# EasyEDA Pro project ProPrj_PEDRO.epro, board PCB1
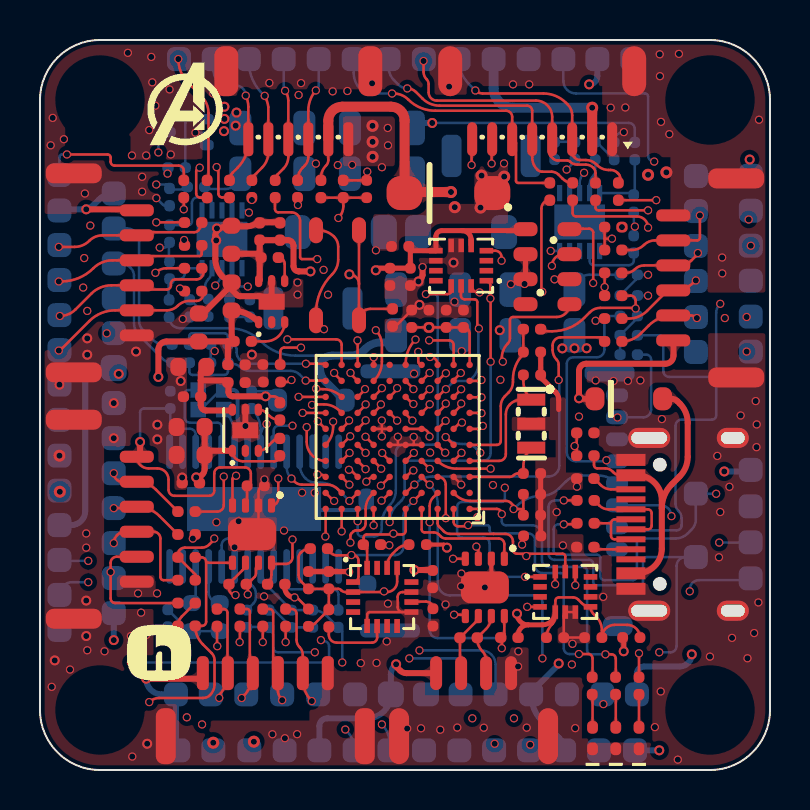
[diagram p4: board, top side]
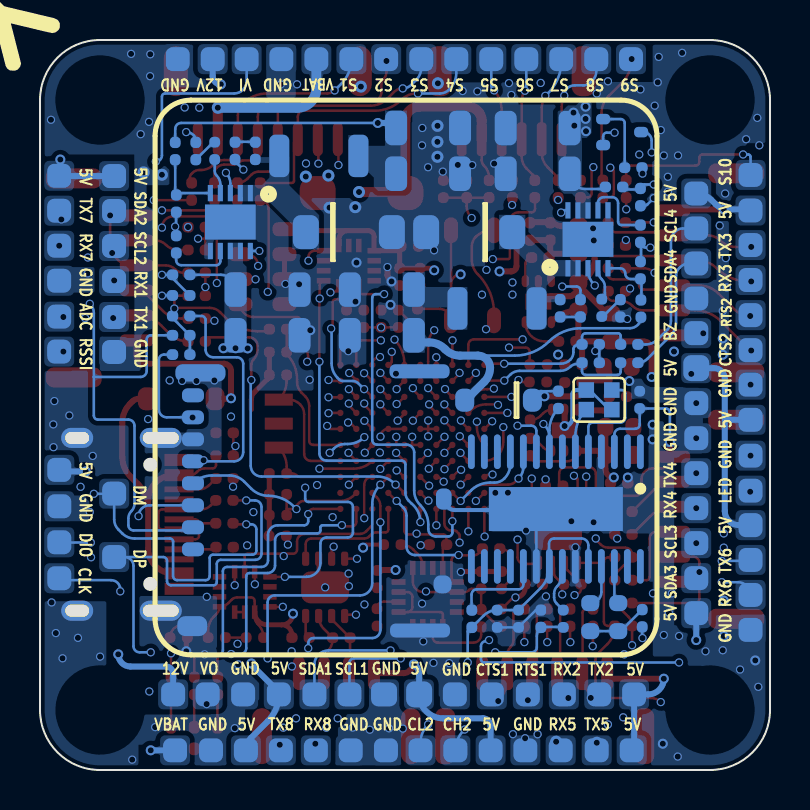
[diagram p5: board, bottom side, seen from below]

Outline 36.5 x 36.5 mm; copper layers: Top Layer, Inner1, Inner2, Inner3, Inner4, Bottom Layer. Coordinates in mm from the lower left corner of the outline.
Outline path: 0,33.5 0,3 arc(0.88,0.88) 3,0 33.5,0 arc(35.62,0.88) 36.5,3 36.5,33.5 arc(35.62,35.62) 33.5,36.5 3,36.5 arc(0.88,35.62) 0,33.5
Stack: Top Layer 0.035mm 外层铜厚1oz / Dielectric1 0.0994mm 3313 RC57% 4.2mil / Inner1 0.0152mm 内层铜厚 / Dielectric2 0.55mm 0.55mm H/H不含铜 / Inner2 0.0152mm 内层铜厚 / Dielectric3 0.1088mm 2116 RC54% 4.9mil / Inner3 0.0152mm 内层铜厚 / Dielectric4 0.55mm 0.55mm H/H不含铜 / Inner4 0.0152mm 内层铜厚 / Dielectric5 0.0994mm 3313 RC57% 4.2mil / Bottom Layer 0.035mm 外层铜厚1oz

## Design rules (mm)
template: 自定义配置
spacing copperThickness1oz (default): track to track 0.102, other pairs 0.12 to 0.3
spacing copperThickness2oz: track to track 0.203, other pairs 0.152 to 0.3
track width copperThickness1oz (default): min 0.127, default 0.127, max 2.54
track width copperThickness2oz: min 0.203, default 0.254, max 2.54
differential pair differentialPair (default): width min 0.127, default 0.254, max 2.54; gap min 0.152, default 0.152
via viaSize (default): diameter min 0.41, default 0.41, max 10; hole min 0.3, default 0.305, max 6.3

## Placement (name value [footprint] x y rotation side)
C22  100nF  [C0402]  20.31 22.56 270 top
C23  100nF  [C0402]  19.45 22.56 270 top
C24  100nF  [C0402]  18.58 22.56 270 top
C25  100nF  [C0402]  21.17 22.56 270 top
C26  100nF  [C0402]  24.6 13.78 180 top
C27  100nF  [C0402]  24.6 12.74 180 top
C32  10nF  [C0402]  25.76 6.62 180 top
C82  33nF  [C0402]  16.33 29.05 270 top
C83  100nF  [C0402]  24.6 20.9 180 top
C84  12pF  [C0402]  24.6 14.83 0 top
C85  12pF  [C0402]  24.6 19.75 180 top
C89  2.2uF  [C0402]  11.6 19.4 0 top
C90  2.2uF  [C0402]  11.57 20.27 0 top
C102  4.7uF  [C0402]  19.65 7.63 270 top
C114  100nF  [C0402]  29.57 6.62 0 top
C115  2.2uF  [C0402]  19.63 9.54 90 top
C117  100nF  [C0402]  18.89 11.27 180 top
C118  2.2uF  [C0402]  14.44 9.49 270 top
C119  2.2uF  [C0402]  13.42 9.49 270 top
C120  100nF  [C0402]  10.34 7.56 90 bottom
C121  100nF  [C0402]  12.57 7.56 270 bottom
C122  100nF  [C0402]  13.64 7.56 270 bottom
C123  100nF  [C0402]  6.52 18.51 90 bottom
C133  10uF  [C0603]  7.59 7.64 270 bottom
C134  10uF  [C0603]  8.99 7.64 270 bottom
C135  10nF  [C0402]  17.5 24.66 90 top
C136  100nF  [C0402]  18.01 26.18 0 top
C137  2.2uF  [C0402]  18.52 24.66 90 top
C138  100nF  [C0402]  27.66 6.62 0 top
C146  100nF  [C0402]  24.61 11.7 180 top
C147  100nF  [C0402]  10.79 14.21 180 top
C150  22uF  [C0603]  7.62 20.15 180 top
C151  10uF  [C0603]  7.53 17.15 0 top
C152  22uF  [C0603]  7.53 15.75 180 top
C153  100nF  [C0402]  7.54 14.35 0 top
C154  100nF  [C0402]  7.6 18.67 0 top
C155  100nF  [C0402]  12 26.92 270 top
C156  22uF  [C0603]  9.57 26.51 90 top
C157  10uF  [C0603]  9.58 23.68 270 top
C158  22uF  [C0603]  7.94 22.13 90 top
C159  100nF  [C0402]  9.83 20.26 180 top
C160  4.7uF  [C1206]  11.62 29.81 180 bottom
C161  4.7uF  [C1206]  11.62 32.1 180 bottom
C162  330pF  [C0402]  8.41 23.11 90 bottom
C163  33uF  [C1206]  19.41 24.02 180 bottom
C164  33uF  [C1206]  19.41 21.73 180 bottom
C165  100nF  [C0402]  10.49 23.08 270 bottom
C166  4.7uF  [C1206]  25.12 24.02 0 bottom
C167  4.7uF  [C1206]  25.12 21.73 0 bottom
C168  470pF  [C0402]  27.76 30.96 270 bottom
C169  22uF  [C1206]  17.1 32.1 0 bottom
C170  22uF  [C1206]  17.1 29.82 0 bottom
C171  100nF  [C0402]  25.73 30.96 90 bottom
CARD4  5033981892  [TF-SMD_503398-1892]  22.58 13.45 90 bottom
D2  SMAJ40A  [SMA_L4.4-W2.6-LS5.0-RD]  20.42 28.85 0 top
D4  DSK34  [SOD-123_L2.8-W1.8-LS3.7-RD]  29.44 18.56 0 top
D5  DSK34  [SOD-123_L2.8-W1.8-LS3.7-RD]  13.57 18.49 0 bottom
D6  SS310  [SMA_L4.3-W2.6-LS5.2-RD]  15.19 26.89 0 bottom
D7  SS310  [SMA_L4.3-W2.6-LS5.2-RD]  20.91 26.89 180 bottom
L3  BLM15PD121SN1D  [L0402]  13.42 7.62 90 top
L8  15uH  [IND-SMD_L4.4-W4.2]  13.65 23.08 180 bottom
L9  10uH  [IND-SMD_L4.4-W4.2]  22.56 30.7 0 bottom
LED6  NCD0402R1  [LED0402-RD]  27.63 1.6 90 top
LED7  NCD0402R1  [LED0402-RD]  28.79 1.6 90 top
LED8  NCD0402R1  [LED0402-RD]  29.95 1.6 90 top
Q4  SS8050W  [SOT-323-3_L2.1-W1.3-P1.30-LS2.3-BR]  7.39 31.89 0 bottom
R56  120Ω  [R0402]  21.43 6.61 0 top
R76  4.7kΩ  [r0402]  13.95 11.07 180 top
R88  4.7kΩ  [r0402]  16.6 11.27 0 top
R99  5.1kΩ  [R0402]  27.27 11.14 0 top
R100  5.1kΩ  [R0402]  27.27 14.57 0 top
R101  22Ω  [R0402]  27.28 13.48 180 top
R102  22Ω  [R0402]  27.28 12.34 180 top
R108  10kΩ  [R0402]  17.63 22.62 90 top
R109  10kΩ  [R0402]  24.6 22.04 0 top
R110  10kΩ  [R0402]  29.44 21.73 0 bottom
R111  10kΩ  [R0402]  29.44 20.77 0 bottom
R118  10kΩ  [R0402]  27.27 16.86 180 top
R119  10kΩ  [R0402]  27.27 15.71 180 top
R126  1K  [R0402]  14.44 7.59 90 top
R128  75Ω  [R0402]  6.39 7.59 270 bottom
R129  75Ω  [R0402]  11.46 7.56 270 bottom
R130  10kΩ  [R0402]  10.58 18.51 90 bottom
R131  10kΩ  [R0402]  14.91 7.56 90 bottom
R133  100Ω  [R0402]  28.92 28.92 90 top
R134  100Ω  [R0402]  27.78 28.92 90 top
R135  100Ω  [R0402]  26.63 28.92 90 top
R136  100Ω  [R0402]  25.49 28.92 90 top
R137  100Ω  [R0402]  12.88 29.05 90 top
R138  100Ω  [R0402]  11.76 29.05 90 top
R139  100Ω  [R0402]  10.59 29.05 90 top
R140  100Ω  [R0402]  9.47 29.05 90 top
R143  10kΩ  [R0402]  29.95 4.21 270 top
R170  20kΩ  [R0402]  14.05 29.05 90 top
R171  1K  [R0402]  15.16 29.05 90 top
R172  120Ω  [R0402]  9.88 9.29 0 top
R173  10kΩ  [R0402]  11.81 9.29 0 top
R174  100Ω  [R0402]  8.36 29.05 90 top
R175  100Ω  [R0402]  7.19 29.05 90 top
R176  100Ω  [R0402]  8.85 7.62 90 top
R177  100Ω  [R0402]  10 7.62 90 top
R178  100Ω  [R0402]  11.14 7.62 90 top
R179  100Ω  [R0402]  12.28 7.62 90 top
R180  100Ω  [R0402]  7.66 27.37 0 top
R181  100Ω  [R0402]  7.66 26.23 0 top
R182  100Ω  [R0402]  7.66 25.09 0 top
R183  100Ω  [R0402]  7.66 23.94 0 top
R184  4.7kΩ  [r0402]  7.33 7.2 0 top
R185  4.7kΩ  [r0402]  7.33 10.63 0 top
R186  100Ω  [R0402]  7.33 9.49 180 top
R187  100Ω  [R0402]  7.33 8.35 180 top
R188  100Ω  [R0402]  7.33 12.92 180 top
R189  100Ω  [R0402]  7.33 11.78 180 top
R190  4.7kΩ  [r0402]  28.66 27.14 0 top
R191  4.7kΩ  [r0402]  28.66 23.72 0 top
R192  100Ω  [R0402]  28.66 24.86 0 top
R193  100Ω  [R0402]  28.66 26 0 top
R194  100Ω  [R0402]  28.66 21.43 0 top
R195  100Ω  [R0402]  28.66 22.57 0 top
R196  10kΩ  [R0402]  29.44 22.7 180 bottom
R197  2.2kΩ  [R0402]  9.83 19.37 180 top
R198  10kΩ  [R0402]  11.99 17.93 90 top
R199  10kΩ  [R0402]  11.99 16.15 270 top
R200  2.2kΩ  [R0402]  10.99 26.92 270 top
R201  10kΩ  [R0402]  11.49 25.62 180 top
R202  10kΩ  [R0402]  10.14 21.43 180 top
R203  17.4kΩ  [R0402]  6.48 28.64 90 bottom
R204  100K  [R0402]  7.8 29.15 0 bottom
R206  47.5kΩ  [R0402]  7.48 23.08 90 bottom
R207  40.2kΩ  [R0402]  6.48 24.99 270 bottom
R209  20Ω  [R0402]  9.48 23.08 270 bottom
R210  17.4kΩ  [R0402]  29.44 23.73 180 bottom
R211  100K  [R0402]  29.44 24.76 180 bottom
R213  16kΩ  [R0402]  28.71 30.95 270 bottom
R214  40.2kΩ  [R0402]  29.69 28.32 90 bottom
R216  20Ω  [R0402]  26.75 30.96 90 bottom
R219  560kΩ  [R0402]  29.74 30.94 90 bottom
R220  220kΩ  [R0402]  6.46 23.07 270 bottom
R221  200kΩ  [R0402]  6.48 26.81 90 bottom
R222  200kΩ  [R0402]  29.69 26.28 270 bottom
R223  4.7kΩ  [r0402]  8.97 20.36 180 bottom
R224  4.7kΩ  [r0402]  8.97 21.28 180 bottom
R225  100Ω  [R0402]  7.04 21.28 180 bottom
R226  100Ω  [R0402]  7.04 20.36 180 bottom
R227  10kΩ  [R0402]  23.47 6.62 0 top
R228  1K  [R0402]  6.83 30.12 0 bottom
R229  220Ω  [R0402]  28.78 4.21 270 top
R230  220Ω  [R0402]  27.61 4.21 270 top
SW3  TS-1089S-02526  [SW-SMD_4P-L4.2-W3.3-P2.15-LS5.1]  14.88 24.74 90 top
U6  AT7456E  [TSSOP-28_L9.7-W4.4-P0.65-LS6.4-BL-EP-2]  10.71 13.05 0 bottom
U30  ICM-42688-P  [LGA-14_L3.0-W2.5-P0.50-TL]  26.26 8.91 0 top
U37  IST8310  [LGA-16_L3.0-W3.0-P0.5-BL]  17.11 8.65 270 top
U38  TJA1051TK/3/1J  [HVSON-8_L3.0-W3.0-P0.65-BL-EP]  22.24 9.13 180 top
U58  ICM-42688-P  [LGA-14_L3.0-W2.5-P0.50-TL]  21.06 25.21 180 top
U59  MS560702BA03-50  [SENSOR-SMD_MS560702BA03-50]  25.38 25.16 0 top
U60  ZX-SH1.0-6PWT  [CONN-SMD_6P-P1.00_MEGASTAR_ZX-SH1.0-6PWT]  12.92 33.24 180 top
U65  STM32H743VIH6  [BGA-100_L8.0-W8.0-P0.80-R10-C10-BL]  17.88 16.66 90 top
U67  TJA1051TK/3/1J  [HVSON-8_L3.0-W3.0-P0.65-BL-EP]  10.6 11.79 180 top
U70  ZX-SH1.0-8PWT  [CONN-SMD_8P-P1.00_MEGASTAR_ZX-SH1.0-8PWT]  25.11 33.24 180 top
U71  BX-GH1.25-4PWT  [CONN-SMD_4P-P1.25_BX-GH1.25-4PWT]  21.68 3.27 0 top
U98  LP5912-3.3DRVT  [wson-6_l2.0-w2.0-p0.65-tl-ep]  10.27 16.99 90 top
U106  -  [焊盘1.3]  8.67 0.98 90 top
U114  -  [焊盘1.3]  6.92 0.98 90 top
U115  -  [焊盘1.3]  12.23 0.98 90 top
U116  -  [焊盘1.3]  10.47 0.98 90 top
U117  -  [焊盘1.3]  0.97 29.75 270 top
U118  -  [焊盘1.3]  6.95 35.54 270 top
U119  ZX-GH1.25-WT6  [CONN-SMD_6P-P1.25_ZX-GH1.25-WT6]  11.27 3.27 0 top
U120  ZX-GH1.25-WT6  [CONN-SMD_6P-P1.25_ZX-GH1.25-WT6]  3.26 24.86 270 top
U121  -  [焊盘1.3]  8.54 3.78 90 top
U122  -  [焊盘1.3]  10.31 3.78 90 top
U123  -  [焊盘1.3]  0.97 26.25 0 top
U124  -  [焊盘1.3]  0.97 24.5 0 top
U125  ZX-GH1.25-WT6  [CONN-SMD_6P-P1.25_ZX-GH1.25-WT6]  3.26 12.54 270 top
U126  ZX-GH1.25-WT6  [CONN-SMD_6P-P1.25_ZX-GH1.25-WT6]  33.24 24.6 90 top
U127  -  [焊盘1.3]  15.73 0.98 90 top
U128  -  [焊盘1.3]  13.97 0.98 270 top
U129  -  [焊盘1.3]  19.2 0.98 270 top
U130  -  [焊盘1.3]  17.47 0.98 270 top
U131  -  [焊盘1.3]  24.46 0.98 270 top
U132  -  [焊盘1.3]  26.21 0.98 270 top
U133  -  [焊盘1.3]  20.96 0.98 270 top
U134  -  [焊盘1.3]  22.71 0.98 270 top
U135  -  [焊盘1.3]  35.54 27.96 0 top
U136  -  [焊盘1.3]  35.54 29.71 0 top
U137  -  [焊盘1.3]  35.54 24.46 0 top
U138  -  [焊盘1.3]  35.54 26.21 0 top
U139  -  [焊盘1.3]  0.97 10.5 0 top
U140  -  [焊盘1.3]  0.97 12.24 0 top
U141  -  [焊盘1.3]  0.97 7 0 top
U142  -  [焊盘1.3]  0.97 8.75 0 top
U143  -  [焊盘1.3]  3.69 27.08 0 top
U144  -  [焊盘1.3]  3.69 28.82 0 top
U145  -  [焊盘1.3]  3.69 23.58 0 top
U146  -  [焊盘1.3]  3.69 25.33 0 top
U147  -  [焊盘1.3]  22.68 35.54 270 top
U148  -  [焊盘1.3]  24.43 35.54 270 top
U149  -  [焊盘1.3]  19.19 35.54 270 top
U150  -  [焊盘1.3]  20.93 35.54 270 top
U151  -  [焊盘1.3]  15.69 35.54 270 top
U152  -  [焊盘1.3]  17.44 35.54 270 top
U153  -  [焊盘1.3]  12.19 35.54 270 top
U154  -  [焊盘1.3]  13.94 35.54 270 top
U155  -  [焊盘1.3]  8.69 35.54 270 top
U156  -  [焊盘1.3]  10.44 35.54 270 top
U157  -  [焊盘1.3]  27.87 35.54 90 top
U158  -  [焊盘1.3]  26.17 35.54 90 top
U159  -  [焊盘1.3]  29.61 35.54 90 top
U160  -  [焊盘1.3]  35.54 22.67 180 top
U161  -  [焊盘1.3]  35.54 20.92 180 top
U162  -  [焊盘1.3]  0.97 27.98 180 top
U163  -  [焊盘1.3]  0.97 19.27 180 top
U164  -  [焊盘1.3]  6.8 3.78 270 top
U165  -  [焊盘1.3]  15.76 3.78 270 top
U166  -  [焊盘1.3]  12.11 3.78 90 top
U167  -  [焊盘1.3]  13.91 3.78 90 top
U168  -  [焊盘1.3]  0.97 22.74 0 top
U169  -  [焊盘1.3]  0.97 20.99 0 top
U170  -  [焊盘1.3]  3.69 14.84 0 top
U171  -  [焊盘1.3]  3.69 13.09 0 top
U172  -  [焊盘1.3]  3.69 7.84 0 top
U173  -  [焊盘1.3]  3.69 16.59 0 top
U174  -  [焊盘1.3]  3.69 11.34 0 top
U175  -  [焊盘1.3]  3.69 9.59 0 top
U176  -  [焊盘1.3]  32.8 22.65 180 top
U177  -  [焊盘1.3]  32.8 24.45 180 top
U178  -  [焊盘1.3]  32.8 29.7 180 top
U179  -  [焊盘1.3]  32.8 20.9 180 top
U180  -  [焊盘1.3]  32.8 26.2 180 top
U181  -  [焊盘1.3]  32.8 27.95 180 top
U182  -  [焊盘1.3#2]  3.69 20.09 180 top
U183  -  [焊盘1.3]  3.69 18.34 180 top
U184  -  [焊盘1.3]  3.69 21.84 180 top
U185  -  [焊盘1.3]  0.97 17.51 180 top
U186  -  [焊盘1.3]  0.97 15.72 180 top
U187  -  [焊盘1.3]  0.97 13.97 180 top
U188  -  [焊盘1.3]  35.54 13.19 0 top
U189  -  [焊盘1.3]  35.54 15.01 0 top
U190  -  [焊盘1.3]  35.54 9.59 0 top
U191  -  [焊盘1.3]  35.54 11.39 0 top
U192  -  [焊盘1.3]  29.75 0.98 90 top
U193  -  [焊盘1.3]  26.35 3.78 90 top
U194  -  [焊盘1.3]  24.56 3.78 90 top
U195  -  [焊盘1.3]  29.84 3.78 90 top
U196  -  [焊盘1.3]  28.12 3.78 90 top
U197  -  [焊盘1.3]  32.79 10.65 0 top
U198  -  [焊盘1.3]  32.79 13.82 0 top
U199  -  [焊盘1.3]  21.03 3.78 90 top
U200  -  [焊盘1.3#2]  17.54 3.78 90 top
U201  -  [焊盘1.3#3]  19.3 3.78 90 top
U202  -  [焊盘1.3]  22.78 3.78 90 top
U203  -  [焊盘1.3]  27.95 0.98 90 top
U204  LP5912-3.3DRVT  [WSON-6_L2.0-W2.0-P0.65-TL-EP]  11.58 23.42 90 top
U205  -  [MP4560DQ]  9.1 26.53 90 bottom
U206  -  [MP4560DQ]  26.98 27.4 270 bottom
USB1  TYPEC-304-BCP16  [USB-C-SMD_TYPEC-304-BCP16_2]  32.09 12.28 90 top
X2  8M Hz  [OSC-SMD_3P-L3.2-W1.3-P1.20-L]  24.56 17.32 270 top
X3  27MHz  [CRYSTAL-SMD_4P-L2.0-W1.6-BL-A]  8.55 18.51 0 bottom

## Footprints (pads in the part's own frame, mm; a bottom-side part is the same pattern mirrored in y, then rotated)
BGA-100_L8.0-W8.0-P0.80-R10-C10-BL
  round 0.32 smd: A1(-3.6,-3.6) A2(-3.6,-2.8) A3(-3.6,-2) A4(-3.6,-1.2) A5(-3.6,-0.4) A6(-3.6,0.4) A7(-3.6,1.2) A8(-3.6,2) A9(-3.6,2.8) A10(-3.6,3.6) B1(-2.8,-3.6) B2(-2.8,-2.8) B3(-2.8,-2) B4(-2.8,-1.2) B5(-2.8,-0.4) B6(-2.8,0.4) B7(-2.8,1.2) B8(-2.8,2) B9(-2.8,2.8) B10(-2.8,3.6) C1(-2,-3.6) C2(-2,-2.8) C3(-2,-2) C4(-2,-1.2) C5(-2,-0.4) C6(-2,0.4) C7(-2,1.2) C8(-2,2) C9(-2,2.8) C10(-2,3.6) D1(-1.2,-3.6) D2(-1.2,-2.8) D3(-1.2,-2) D4(-1.2,-1.2) D5(-1.2,-0.4) D6(-1.2,0.4) D7(-1.2,1.2) D8(-1.2,2) D9(-1.2,2.8) D10(-1.2,3.6) E1(-0.4,-3.6) E2(-0.4,-2.8) E3(-0.4,-2) E4(-0.4,-1.2) E5(-0.4,-0.4) E6(-0.4,0.4) E7(-0.4,1.2) E8(-0.4,2) E9(-0.4,2.8) E10(-0.4,3.6) F1(0.4,-3.6) F2(0.4,-2.8) F3(0.4,-2) F4(0.4,-1.2) F5(0.4,-0.4) F6(0.4,0.4) F7(0.4,1.2) F8(0.4,2) F9(0.4,2.8) F10(0.4,3.6) G1(1.2,-3.6) G2(1.2,-2.8) G3(1.2,-2) G4(1.2,-1.2) G5(1.2,-0.4) G6(1.2,0.4) G7(1.2,1.2) G8(1.2,2) G9(1.2,2.8) G10(1.2,3.6) H1(2,-3.6) H2(2,-2.8) H3(2,-2) H4(2,-1.2) H5(2,-0.4) H6(2,0.4) H7(2,1.2) H8(2,2) H9(2,2.8) H10(2,3.6) J1(2.8,-3.6) J2(2.8,-2.8) J3(2.8,-2) J4(2.8,-1.2) J5(2.8,-0.4) J6(2.8,0.4) J7(2.8,1.2) J8(2.8,2) J9(2.8,2.8) J10(2.8,3.6) K1(3.6,-3.6) K2(3.6,-2.8) K3(3.6,-2) K4(3.6,-1.2) K5(3.6,-0.4) K6(3.6,0.4) K7(3.6,1.2) K8(3.6,2) K9(3.6,2.8) K10(3.6,3.6)
C0402
  rrect 0.54x0.54 smd: 1(-0.433,0) 2(0.433,0)
C0603
  rrect 0.8x0.9 smd: 1(-0.7,0) 2(0.7,0)
C1206
  rrect 1.1x1.728 smd: 1(-1.6,0) 2(1.6,0)
CONN-SMD_4P-P1.25_BX-GH1.25-4PWT
  rrect 0.6x1.7 smd: 1(-1.875,1.575) 2(-0.625,1.575) 3(0.625,1.575) 4(1.875,1.575)
  rrect 1x2.8 smd: 5(3.725,-1.575) 6(-3.725,-1.575)
CONN-SMD_6P-P1.00_MEGASTAR_ZX-SH1.0-6PWT
  rrect 0.5x1.7 smd: 1(-2.5,1.7) 2(-1.5,1.7) 3(-0.5,1.7) 4(0.5,1.7) 5(1.5,1.7) 6(2.5,1.7)
  rrect 1.2x2.5 smd: 7(3.6,-1.7) 8(-3.6,-1.7)
CONN-SMD_6P-P1.25_ZX-GH1.25-WT6
  rrect 0.6x1.7 smd: 1(-3.125,1.575) 2(-1.875,1.575) 3(-0.625,1.575) 4(0.625,1.575) 5(1.875,1.575) 6(3.125,1.575)
  rrect 1x2.8 smd: 7(4.975,-1.575) 8(-4.975,-1.575)
CONN-SMD_8P-P1.00_MEGASTAR_ZX-SH1.0-8PWT
  rrect 0.5x1.7 smd: 1(-3.5,1.7) 2(-2.5,1.7) 3(-1.5,1.7) 4(-0.5,1.7) 5(0.5,1.7) 6(1.5,1.7) 7(2.5,1.7) 8(3.5,1.7)
  rrect 1.2x2.5 smd: 9(4.6,-1.7) 10(-4.6,-1.7)
CRYSTAL-SMD_4P-L2.0-W1.6-BL-A
  rect 0.775x0.775 smd: 1(-0.638,-0.488) 2(0.638,-0.488) 3(0.638,0.488) 4(-0.638,0.488)
HVSON-8_L3.0-W3.0-P0.65-BL-EP
  rrect 0.355x0.711 smd: 1(-0.975,-1.433) 2(-0.325,-1.433) 3(0.325,-1.433) 4(0.975,-1.433) 5(0.975,1.433) 6(0.325,1.433) 7(-0.325,1.433) 8(-0.975,1.433)
  rrect 2.4x1.6 smd: 9(0,0)
IND-SMD_L4.4-W4.2
  rrect 1x2.12 smd: 1(1.978,0) 2(-1.978,0)
L0402
  rrect 0.54x0.54 smd: 1(-0.433,0) 2(0.433,0)
LED0402-RD
  rrect 0.636x0.54 smd: 1(-0.538,0) 2(0.538,0)
LGA-14_L3.0-W2.5-P0.50-TL
  rect 0.675x0.28 smd: 1(-1.262,0.75) 2(-1.262,0.25) 3(-1.262,-0.25) 4(-1.262,-0.75) 8(1.262,-0.75) 9(1.262,-0.25) 10(1.262,0.25) 11(1.262,0.75)
  rect 0.28x0.675 smd: 5(-0.5,-1.012) 6(0,-1.012) 7(0.5,-1.012) 12(0.5,1.012) 13(0,1.012) 14(-0.5,1.012)
LGA-16_L3.0-W3.0-P0.5-BL
  rect 0.28x0.7 smd: 1(-0.75,-1.451) 2(-0.25,-1.451) 3(0.25,-1.451) 4(0.75,-1.451) 9(0.75,1.462) 10(0.25,1.462) 11(-0.25,1.462) 12(-0.75,1.462)
  rect 0.7x0.28 smd: 5(1.447,-0.75) 6(1.447,-0.25) 7(1.447,0.25) 8(1.447,0.75) 13(-1.46,0.75) 14(-1.46,0.25) 15(-1.46,-0.25) 16(-1.46,-0.75)
MP4560DQ
  rect 0.813x0.254 smd: 1(-1.448,1) 2(-1.448,0.5) 3(-1.448,0) 4(-1.448,-0.5) 5(-1.448,-1) 6(1.448,-1) 7(1.448,-0.5) 8(1.448,0) 9(1.448,0.5) 10(1.448,1)
  rect 1.752x2.54 smd: EPAD(0,0)
OSC-SMD_3P-L3.2-W1.3-P1.20-L
  rect 0.6x1.4 smd: 1(-1.199,0) 2(0,0) 3(1.199,0)
R0402
  rrect 0.566x0.54 smd: 1(-0.433,0) 2(0.433,0)
r0402
  rrect 0.566x0.54 smd: 1(-0.433,0) 2(0.433,0)
SENSOR-SMD_MS560702BA03-50
  rrect 1.2x0.7 smd: 1(-1.1,1.875) 2(-1.1,0.625) 3(-1.1,-0.625) 4(-1.1,-1.875) 5(1.1,-1.875) 6(1.1,-0.625) 7(1.1,0.625) 8(1.1,1.875)
SMA_L4.3-W2.6-LS5.2-RD
  rrect 1.3x1.7 smd: 1(-2.3,0) 2(2,0)
SMA_L4.4-W2.6-LS5.0-RD
  rrect 1.8x1.7 smd: 1(-2.192,0) 2(2.192,0)
SOD-123_L2.8-W1.8-LS3.7-RD
  rrect 0.95x1.15 smd: 1(-1.692,0) 2(1.692,0)
SOT-323-3_L2.1-W1.3-P1.30-LS2.3-BR
  rrect 0.7x0.525 smd: 1(0.95,-0.65) 2(0.95,0.65) 3(-0.95,0)
SW-SMD_4P-L4.2-W3.3-P2.15-LS5.1
  rrect 1.3x0.7 smd: 1(-2.25,1.075) 2(2.25,1.075) 3(-2.25,-1.075) 4(2.25,-1.075)
TF-SMD_503398-1892
  rrect 0.7x1.1 smd: 1(-2.42,6.27) 2(-1.32,6.27) 3(-0.22,6.27) 4(0.88,6.27) 5(1.98,6.27) 6(3.08,6.27) 7(4.18,6.27) 8(5.28,6.27)
  rrect 1.05x0.78 smd: 9(0.095,-6.27)
  rrect 0.9x0.9 smd: 10(-4.17,-6.21)
  rrect 0.7x3 smd: 11(-6.48,-5.084) 11(6.48,-5.059)
  rrect 1x1.5 smd: 11(-6.26,6.306)
  rrect 0.86x2.5 smd: 11(6.4,5.897)
TSSOP-28_L9.7-W4.4-P0.65-LS6.4-BL-EP-2
  oval 0.343x1.732 smd: 1(-4.225,-2.866) 2(-3.575,-2.866) 3(-2.925,-2.866) 4(-2.275,-2.866) 5(-1.625,-2.866) 6(-0.975,-2.866) 7(-0.325,-2.866) 8(0.325,-2.866) 9(0.975,-2.866) 10(1.625,-2.866) 11(2.275,-2.866) 12(2.925,-2.866) 13(3.575,-2.866) 14(4.225,-2.866) 15(4.225,2.866) 16(3.575,2.866) 17(2.925,2.866) 18(2.275,2.866) 19(1.625,2.866) 20(0.975,2.866) 21(0.325,2.866) 22(-0.325,2.866) 23(-0.975,2.866) 24(-1.625,2.866) 25(-2.275,2.866) 26(-2.925,2.866) 27(-3.575,2.866) 28(-4.225,2.866)
  rect 6.7x2.2 smd: 29(0,0)
USB-C-SMD_TYPEC-304-BCP16_2
  oval 1.001x2.1 hole 0.6x1.801: 13(-4.321,1.633) 14(4.321,1.633)
  oval 1.001x1.6 hole 0.6x1.199: 15(-4.321,-2.547) 16(4.321,-2.547)
  rect 0.6x1.45 smd: A1B12(-3.226,2.547) A4B9(-2.451,2.547) B1A12(3.22,2.547) B4A9(2.451,2.547)
  rect 0.299x1.45 smd: A5(-1.25,2.547) A6(-0.249,2.547) A7(0.249,2.547) A8(1.25,2.547) B5(1.75,2.547) B6(0.75,2.547) B7(-0.75,2.547) B8(-1.75,2.547)
wson-6_l2.0-w2.0-p0.65-tl-ep
  oval 0.607x0.364 smd: 1(-1.028,0.65) 2(-1.028,0) 3(-1.028,-0.65) 4(1.028,-0.65) 5(1.028,0) 6(1.028,0.65)
  rect 0.8x1.3 smd: 7(0,0)
WSON-6_L2.0-W2.0-P0.65-TL-EP
  oval 0.607x0.364 smd: 1(-1.028,0.65) 2(-1.028,0) 3(-1.028,-0.65) 4(1.028,-0.65) 5(1.028,0) 6(1.028,0.65)
  rect 0.8x1.3 smd: 7(0,0)
焊盘1.3
  rrect 1.2x1.2 smd far side: 1(0,0)
焊盘1.3#2
  rrect 1.3x1.3 smd far side: 1(0,0)
焊盘1.3#3
  rrect 1.2x1.3 smd far side: 1(0,0)

## Nets
As in the schematic.

Pads without a net: CARD4 1 8; U6 1 2 7 12 13 14 15 16 17 18 27 28; U30 2 3 10 11; U37 3 4 7 8 12 15; U58 2 3 10 11; U59 4; U65 B1 J4 J6 K6; U98 2; U204 2; USB1 A8 B8

## Via types
v1: diameter 0.41, hole 0.305, Top Layer to Bottom Layer, 373 vias
v2: diameter 0.5, hole 0.305, Top Layer to Bottom Layer, 54 vias
v3: diameter 0.6, hole 0.305, Top Layer to Bottom Layer, 17 vias

## Routing (per net, layer and track width the routed paths; a pad name or vN(x,y) marks a point on that pad's centre or on a via; arc(x,y) is an arc through that point)
3V3_ADC: length 37.4
  Top Layer w0.127: U65.H4 19.46,19.03 arc(19.47,19.04) v1(19.48,19.04)
  Inner2 w0.127: 34.37,22.6 34.01,22.6 arc(33.8,22.51) 33.71,22.29 33.71,18.43 arc(33.6,18.18) 33.35,18.08 32.18,18.08 arc(32,18) 31.93,17.82 31.93,14.62 arc(31.84,14.41) 31.62,14.32 28.27,14.32 arc(28.06,14.23) 27.97,14.01 27.97,9.9 arc(27.64,9.11) 26.85,8.78 25.63,8.78 arc(23.38,9.23) 21.47,10.5 21.16,10.81 arc(20.9,11.21) 20.8,11.67 20.8,12.73 arc(20.76,12.93) 20.65,13.1 arc(20.46,13.38) 20.4,13.71 20.4,14.11 arc(20.24,14.92) 19.78,15.59 v1(19.51,15.87)
  Inner3 w0.127: v1(34.24,22.6) 35.28,22.6 arc(35.32,22.61) v1(35.33,22.65) ; 19.48,15.84 arc(19.2,15.96) 19.08,16.25 19.08,18.64 arc(19.2,18.92) v1(19.48,19.04)
3V3_IMU: length 88.3
  Top Layer w0.127: 25.77,7.9 25.77,8.46 arc(25.82,8.58) 25.94,8.63 26.65,8.63 arc(26.79,8.6) 26.91,8.52 27.09,8.34 arc(27.29,8.21) 27.53,8.16 ; U30.5 25.76,7.63 arc(25.73,7.46) 25.63,7.31 25.59,7.27 arc(25.39,6.97) C32.2 ; L3.2 12.93,8.55 arc(12.84,8.61) v1(12.73,8.63) ; U30.8 arc(27.56,7.97) 27.67,7.8 27.81,7.66 arc(28.02,7.35) 28.09,6.99 C138.2 arc(28.28,7.07) 28.73,7.26 29.36,7.26 arc(29.81,7.07) C114.2
  Top Layer w0.24: R227.2 23.9,6.75 arc(24.05,7.11) 24.41,7.26 ; 24.41,7.26 25.13,7.26 arc(25.58,7.44) U30.5 ; 24.41,7.26 arc(24.02,7.42) v2(23.85,7.82)
  Top Layer w0.25: U58.5 21.56,26.52 arc(21.43,26.84) 21.11,26.97 ; 21.11,26.97 24.2,26.97 arc(24.25,26.99) U59.1 ; 21.11,26.97 20.09,26.97 arc(19.88,26.88) 19.8,26.67 U58.8 18.6,25.96 arc(18.54,25.94) 18.52,25.89 ; 18.52,25.89 18.52,26.11 arc(18.5,26.16) C136.2 ; 18.52,25.89 C137.2 C135.2 16.89,25.09 arc(16.82,25.06) v2(16.79,24.99)
  Top Layer w0.254: 12.24,9.29 12.24,9.11 arc(12.39,8.77) v1(12.73,8.63)
  Top Layer w0.3: v2(5.92,19.65) 5.92,21.02 arc(6.04,21.31) 6.32,21.43 C158.1 arc(7.95,21.43) 7.95,21.43 9.38,21.43 ; 9.38,21.43 R202.2 arc(9.61,21.56) 9.58,21.72 C157.2 arc(10.29,22.83) 10.89,22.43 U204.1 ; 9.38,21.43 arc(9.39,21.42) 9.4,21.4 C159.2 ; v2(18.72,10) 19.61,10 arc(19.63,9.99) C115.2
  Inner3 w0.3: v2(18.72,10) 20.04,10 arc(20.4,9.85) 20.55,9.49 20.55,9.03 arc(20.71,8.64) 21.11,8.48 23.29,8.48 arc(23.65,8.33) 23.8,7.97
  Inner4 w0.3: v2(16.79,24.99) 16.79,23.77 arc(16.63,23.37) 16.23,23.21 6.88,23.21 arc(6.2,22.93) 5.92,22.24 v2(5.92,19.65) arc(5.77,19.29) 5.41,19.14 2.67,19.14 arc(2.34,19.01) 2.21,18.69 2.21,14.42 arc(2.33,14.13) 2.62,14.01 4.04,14.01 arc(4.4,13.86) 4.55,13.51 4.55,10.36 arc(4.7,10) 5.06,9.85 12.48,9.85 arc(12.65,9.78) 12.73,9.6 v1(12.73,8.63) arc(12.79,8.48) 12.93,8.43 15.88,8.43 arc(16.24,8.57) 16.38,8.93 16.38,9.64 arc(16.49,9.9) 16.74,10 v2(18.72,10)
